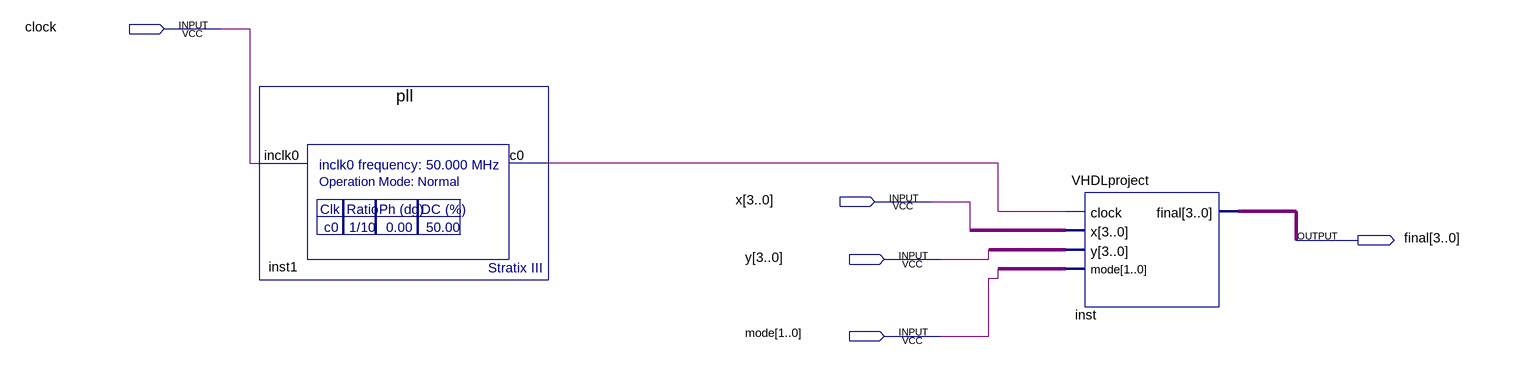
[diagram p0: schematic sheet]
// Quartus schematic project.bdf as structural Verilog: 2 symbols, 5 pins
module project (
  input  clock,
  input  [3:0] x,
  input  [3:0] y,
  input  [1:0] mode,
  output [3:0] \final 
);

  wire inst1_c0;
  wire [1:0] undriven_3;
  wire [3:0] undriven, undriven_2;

  pll inst1 (.inclk0(clock), .c0(inst1_c0));
  VHDLproject inst (.clock(inst1_c0), .x(undriven), .y(undriven_2), .mode(undriven_3), .\final (\final ));
endmodule
